# EAGLE design v1 (EAGLE 8.7.1)
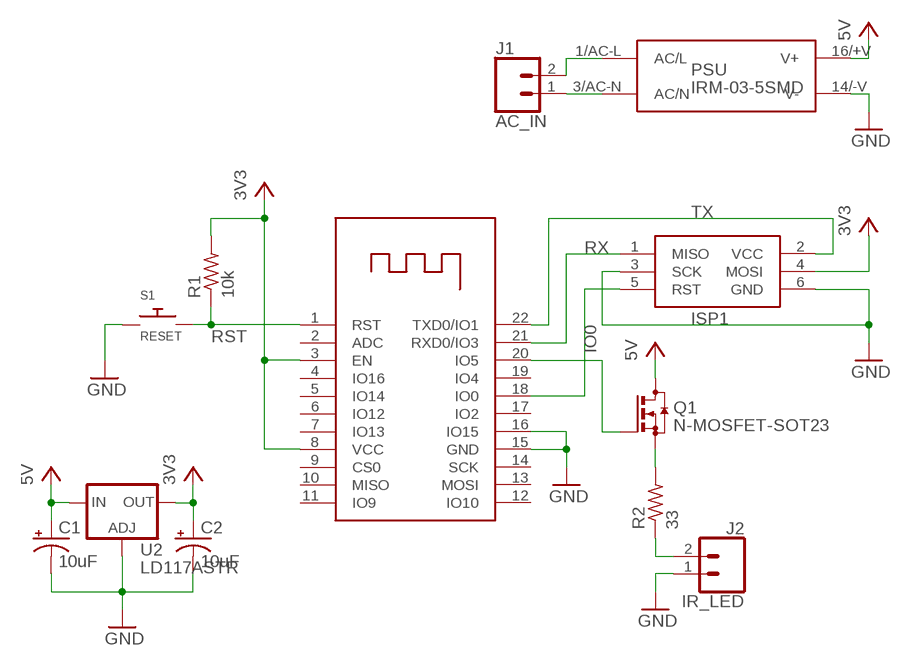
[diagram p0: schematic, sheet 1]

## Parts
C1  10uF  CPOL-US153CLV-0405  [153CLV-0405]
C2  10uF  CPOL-US153CLV-0405  [153CLV-0405]
ISP1  AVRISP-6  [AVRISP]
J1  AC_IN  1X2_5MM_SCREW  [1X2_5MM_SCREW]
J2  IR_LED  1X2_5MM_SCREW  [1X2_5MM_SCREW]
PSU  IRM-03-5SMD  [IRM-03-5S]
Q1  N-MOSFET-SOT23  [SOT23]
R1  10k  R-US_R0805  [R0805]
R2  33  R-US_MELF0207R  [MINI_MELF-0207R]
S1  RESET  BUTTON  [B3F-1000]
U1  ESP-12F  [ESP-12F]
U2  LD117ASTR  [SOT223]

## Nets
3V3: C2.+ ISP1.4(MOSI) R1.2 U1.3(EN) U1.8(VCC) U2.4(OUT)
5V: C1.+ PSU.16/+V(V+) Q1.3(D) U2.3(IN)
AC/L: J1.2 PSU.1/AC-L(AC/L)
AC/N: J1.1 PSU.3/AC-N(AC/N)
GND: C1.- C2.- ISP1.3(SCK) ISP1.6(GND) J2.1 PSU.14/-V(V-) S1.1 S1.2 U1.15(GND) U1.16(IO15) U2.1(ADJ)
IO0: ISP1.5(RST) U1.18(IO0)
LED: Q1.1(G) U1.20(IO5)
N$5: Q1.2(S) R2.2
N$6: J2.2 R2.1
RST: R1.1 S1.3 S1.4 U1.1(RST)
RX: ISP1.1(MISO) U1.21(RXD0/IO3)
TX: ISP1.2(VCC) U1.22(TXD0/IO1)
Unconnected: U1.2(ADC) U1.4(IO16) U1.5(IO14) U1.6(IO12) U1.7(IO13) U1.9(CS0) U1.10(MISO) U1.11(IO9) U1.12(IO10) U1.13(MOSI) U1.14(SCK) U1.17(IO2) U1.19(IO4)

## Library data of the parts
C1 C2 = resistor:CPOL-US: POLARIZED CAPACITOR, American symbol
ISP1 = my_parts:AVRISP: AVR ISP HEADER Standard 6 pin header for AVR programming
J1 J2 = my_parts:1X2_5MM_SCREW
PSU = my_parts:IRM-03-5
Q1 = my_parts:N-MOSFET
R1 R2 = resistor:R-US_: RESISTOR, American symbol
S1 = my_parts:BUTTON
U1 = my_parts:ESP-12F
U2 = v-reg:LD117A?*: Low drop fixed and adjustable positive voltage regulators 1 A Source: http://www.st.com/stonline/products/literature/ds/7194/ld1117axx.pdf

## Board
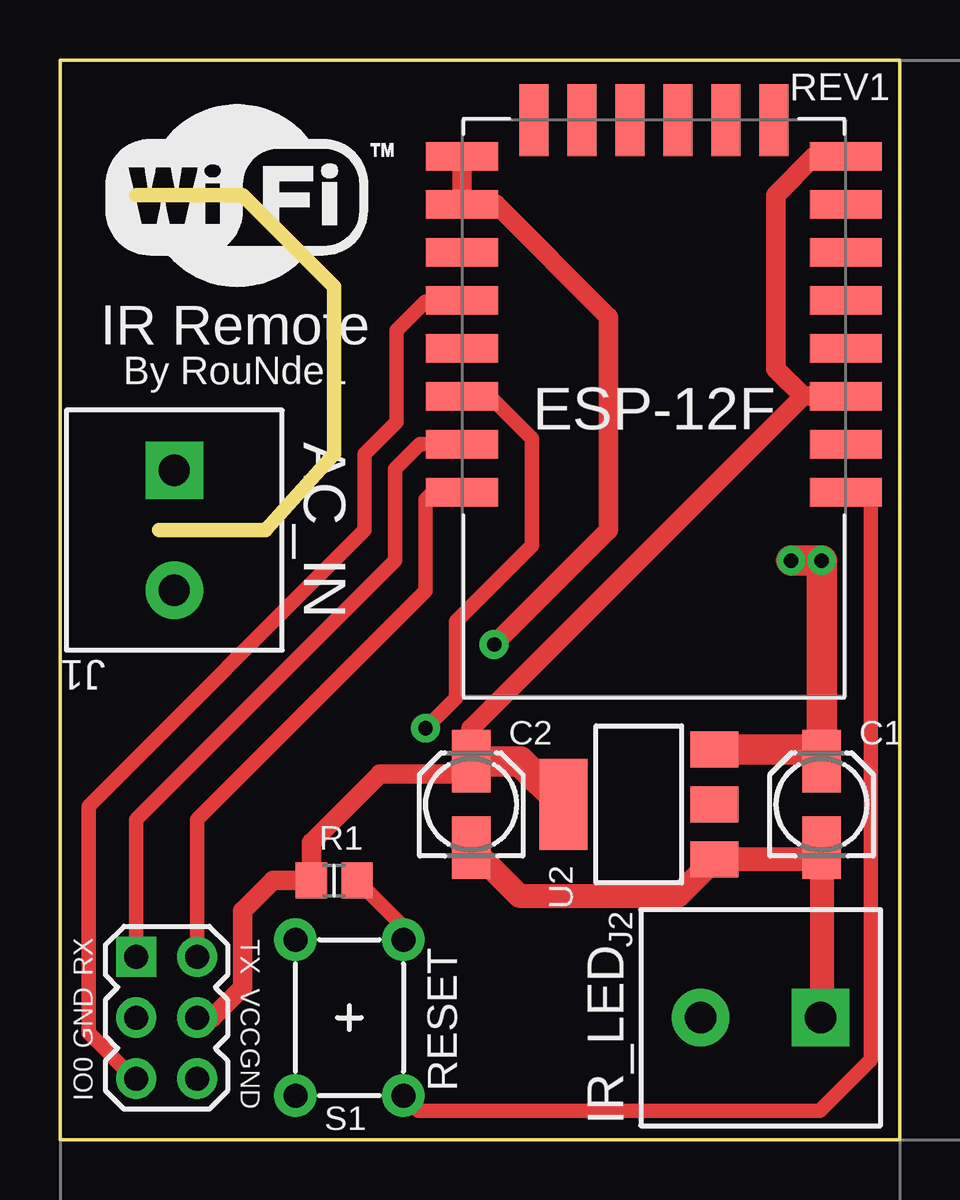
[diagram p1: board, top side]
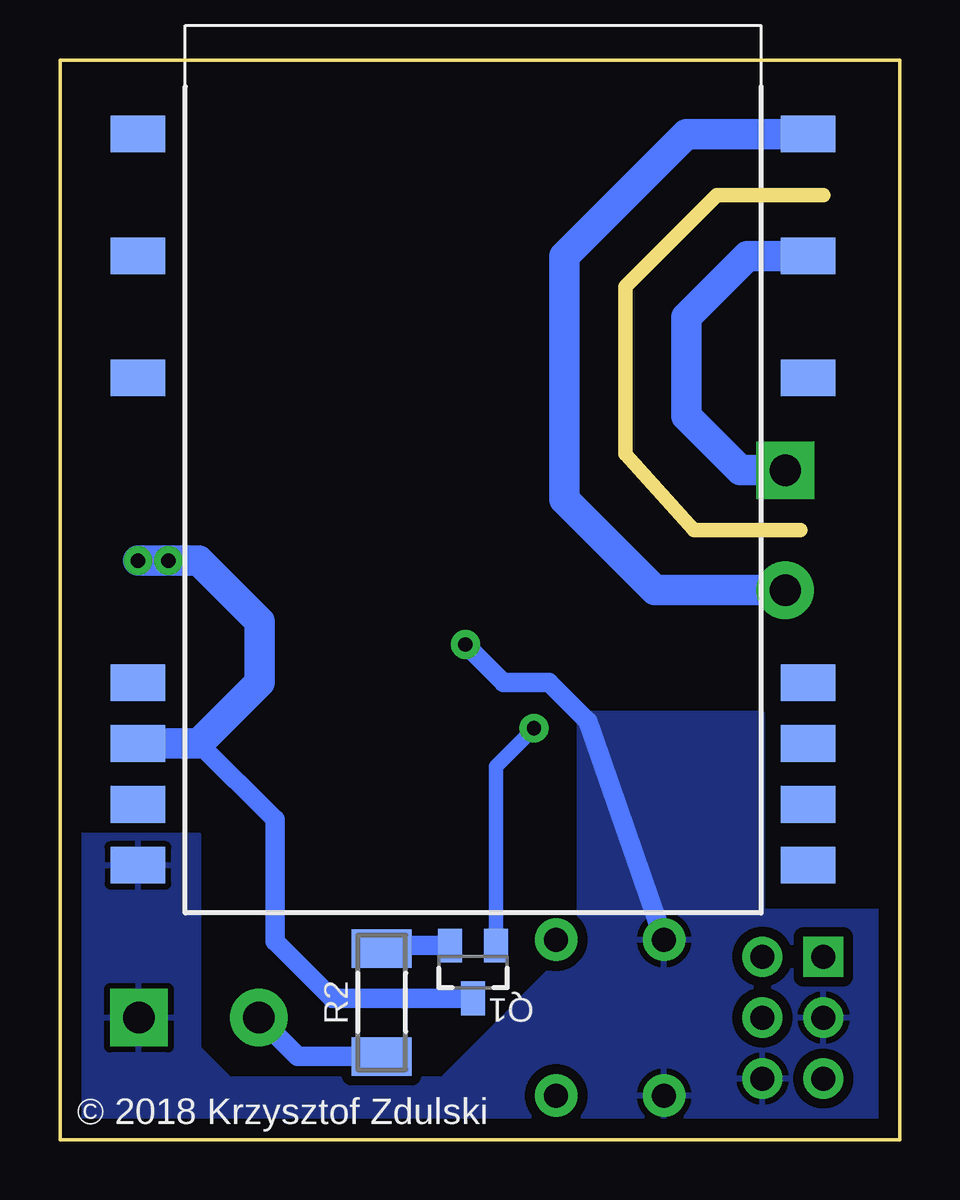
[diagram p2: board, bottom side, seen from below]

Size 35 x 45 mm. Coordinates in mm from the lower left corner, seen from the top.
Outline: 0,0 35,0 35,45 0,45 0,0
Copper layers (1*16): Top 0.035mm / dielectric 1.5mm / Bottom 0.035mm
Design rules "default *": minimum track width 6mil, minimum drill 0.35mm, track to track 6mil, track to pad 6mil, pad to pad 6mil, via to via 6mil, smd to smd 6mil, copper to edge 32mil, drill to drill 6mil, minimum pad ring 10mil, minimum via ring 8mil, stop-mask expansion 4mil, vias tented up to drill 0.6mm, thermal gap 10mil
Milling: 6 lines

### Footprints (pad centres in the part's own frame; a part is rotated, then mirrored left to right if it is on the bottom)
153CLV-0405 = smd 2.6 x 1.6: + 1.8,0; - -1.8,0
AVRISP = drill 1 pad 1.676 square: 1 -1.27,2.54 | drill 1 pad 1.676: 2 1.27,2.54; 3 -1.27,0; 4 1.27,0; 5 -1.27,-2.54; 6 1.27,-2.54
1X2_5MM_SCREW = drill 1.3 pad 2.4 square: 1 2.5,0 | drill 1.3 pad 2.4: 2 -2.5,0
IRM-03-5S = smd 1.524 x 2.286: 1/AC-L -13.97,13.97; 3/AC-N -8.89,13.97; 5 -3.81,13.97; 10 8.89,13.97; 11 11.43,13.97; 12 13.97,13.97; 13 16.51,13.97; 14/-V 16.51,-13.97; 15 13.97,-13.97; 16/+V 11.43,-13.97; 17 8.89,-13.97; 22 -3.81,-13.97; 24 -8.89,-13.97; 26 -13.97,-13.97
SOT23 = smd 1 x 1.4: 1 -0.95,-1.1; 2 0.95,-1.1; 3 0,1.1
R0805 = smd 1.3 x 1.5: 1 -0.95,0; 2 0.95,0
MINI_MELF-0207R = smd 1.6 x 2.5: 1 -2.25,0; 2 2.25,0
B3F-1000 = drill 1 pad 1.778: 1 -3.25,2.25; 2 3.25,2.25; 3 -3.25,-2.25; 4 3.25,-2.25
ESP-12F = smd 3 x 1.2: 1 -8,3.5; 2 -8,1.5; 3 -8,-0.5; 4 -8,-2.5; 5 -8,-4.5; 6 -8,-6.5; 7 -8,-8.5; 8 -8,-10.5; 15 8,-10.5; 16 8,-8.5; 17 8,-6.5; 18 8,-4.5; 19 8,-2.5; 20 8,-0.5; 21 8,1.5; 22 8,3.5 | smd 1.2 x 3: 9 -5,-12; 10 -3,-12; 11 -1,-12; 12 1,-12; 13 3,-12; 14 5,-12
SOT223 = smd 1.5 x 2: 1 -2.3,-3.15; 2 0,-3.15; 3 2.3,-3.15 | smd 3.8 x 2: 4 0,3.15

### Placement (x,y rotation side)
C1  31.75,13.97 90 top
C2  17.14,13.97 90 top
ISP1  4.45,5.08 0 top
J1  4.76,25.4 90 top
J2  29.21,5.08 0 top
PSU  17.78,27.94 270 bottom
Q1  17.78,6.99 180 bottom
R1  11.43,10.79 180 top
R2  21.59,5.71 90 bottom
S1  12.06,5.08 90 top
U1  24.77,30.48 180 top
U2  24.13,13.97 90 top

### Tracks (layer width: path | path; a pad name or v marks a point on that pad's centre or on a via)
3V3
  Top 0.813: U1.3 30.98,30.98 | 30.98,30.98 17.14,17.14 C2.+ 17.14,15.24 13.34,15.24 10.48,12.38 R1.2 8.89,10.79 7.62,9.53 7.62,6.35 6.35,5.08 ISP1.4 | U1.8 31.45,40.98 29.84,39.37 29.84,32.12 30.98,30.98
  Top 1.27: U2.4 19.18,15.77 C2.+
5V  (via drill 0.6 pad 1.2)
  Top 1.27: U2.3 31.25,16.27 arc-90 C1.+ v31.75,24.13 v30.48,24.13
  Bottom 0.813: Q1.3 23.66,5.88 26.04,8.26 26.04,13.34 29.21,16.51
  Bottom 1.27: PSU.16/+V 29.21,16.51 26.67,19.05 26.67,21.59 29.21,24.13 v30.48,24.13 v31.75,24.13
AC/L
  Bottom 1.27: J1.2 10.2,22.9 13.97,26.67 13.97,36.83 8.89,41.91 PSU.1/AC-L
AC/N
  Bottom 1.27: PSU.3/AC-N 6.35,36.83 8.89,34.29 8.89,30.16 6.63,27.9 J1.1
GND  (via drill 0.6 pad 1.2)
  Top 0.813: U1.15 U1.16 18.17,38.98 22.86,34.29 22.86,25.4 v18.1,20.64
  Top 1: J2.1 31.75,5.12 C1.- 31.25,11.67 U2.1 25.77,10.16 19.16,10.16 C2.-
  Bottom 0.813: v18.1,20.64 16.51,19.05 14.61,19.05 12.99,17.43 S1.2
  pour Bottom (isolate 0.406): 34.92,12.7 29.21,12.7 29.21,3.81 27.94,2.54 19.05,2.54 13.34,8.26 13.34,17.78 5.71,17.78 5.71,9.53 0,9.53 0,0 34.92,0
IO0
  Top 0.61: U1.18 15.24,34.92 14.03,33.71 14.03,29.9 12.7,28.57 12.7,25.4 1.19,13.89 1.19,4.45 3.1,2.54 ISP1.5
LED  (via drill 0.6 pad 1.2)
  Top 0.61: v15.24,17.14 16.51,18.41 16.51,21.59 19.68,24.77 19.68,29.21 17.91,30.98 U1.20
  Bottom 0.61: Q1.1 16.83,15.55 v15.24,17.14
N$5
  Bottom 0.813: Q1.2 22.11,8.09 R2.2
N$6
  Bottom 0.813: R2.1 25.09,3.46 J2.2
RST
  Top 0.61: S1.3 14.95,1.19 31.67,1.19 33.81,3.33 33.81,26.57 U1.1 | R1.1 14.31,8.86 S1.4
RX
  Top 0.61: ISP1.1 3.17,13.34 13.97,24.13 13.97,27.94 15.01,28.98 U1.21
TX
  Top 0.61: ISP1.2 5.71,13.34 15.24,22.86 15.24,26.67 15.55,26.98 U1.22

### Text on the board
_tplace: REV1 | IR Remote | By RouNdeL | ESP-12F | RX | TX | GND | VCC | IO0 | GND
_bplace: © 2018 Krzysztof Zdulski